# Altium schematic sheet Dashboard.SchDoc
size Letter
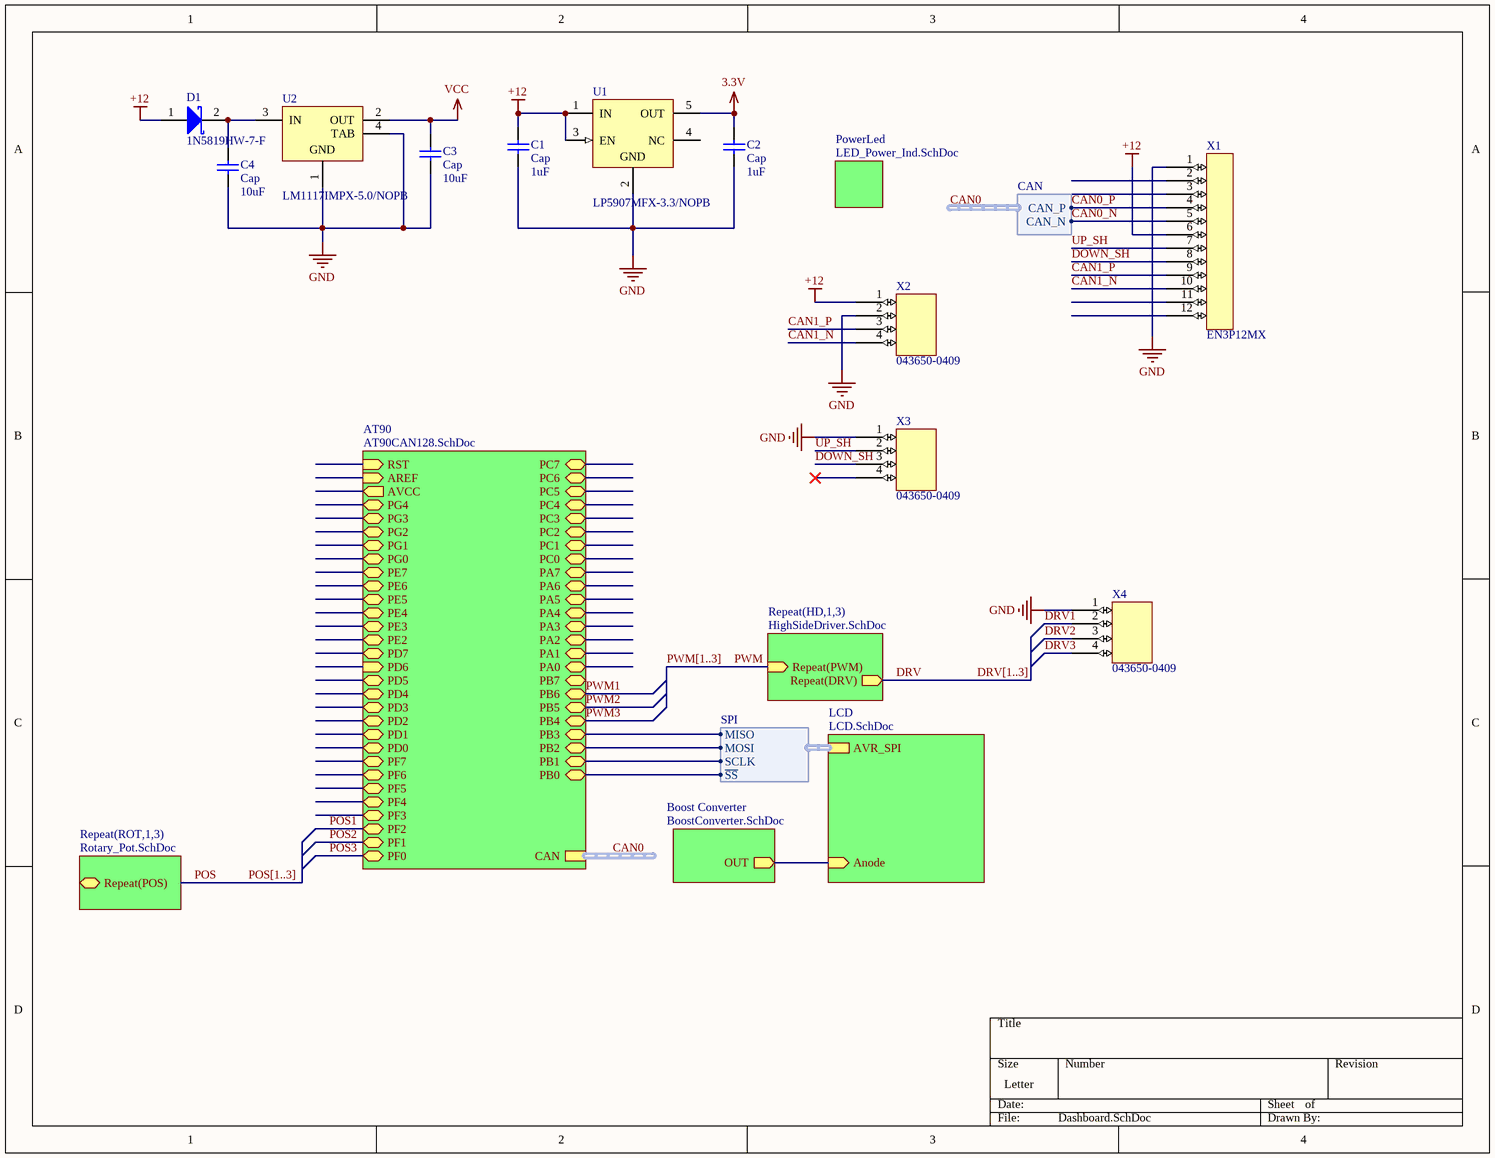
[diagram p0: Dashboard.SchDoc]

## Parts
C1  Cap  value 1uF  [1608[0603]]
C2  Cap  value 1uF  [1608[0603]]
C3  Cap  value 10uF  [1608[0603]]
C4  Cap  value 10uF  [1608[0603]]
D1  1N5819HW-7-F  [DIOD-SOD-123-2_V]
U1  LP5907MFX-3.3/NOPB  [DBV0005A_L]
U2  LM1117IMPX-5.0/NOPB  [MP04A_M]
X1  EN3P12MX  [EN3P12MX]
X2  043650-0409  [043650-0409]
X3  043650-0409  [043650-0409]
X4  043650-0409  [043650-0409]

## Sub-sheets
AT90 = AT90CAN128.SchDoc: PD6 (in), PD5 (bidir), RST (in), AREF (in), AVCC (out), PG2 (bidir), PG1 (bidir), PG0 (bidir), PE7 (bidir), PE6 (bidir), PE5 (bidir), PE4 (bidir), PE3 (bidir), PE2 (bidir), PD7 (bidir), PD4 (bidir), PD3 (bidir), PD2 (bidir), PD1 (bidir), PD0 (bidir), PF7 (bidir), PF6 (bidir), PF5 (bidir), PF4 (bidir), PF3 (bidir), PF2 (bidir), PF1 (bidir), PF0 (bidir), PC7 (bidir), PC6 (bidir), PC5 (bidir), PC4 (bidir), PC3 (bidir), PC2 (bidir), PC1 (bidir), PC0 (bidir), PA7 (bidir), PA6 (bidir), PA5 (bidir), PA4 (bidir), PA0 (bidir), PG4 (bidir), PA3 (bidir), PA2 (bidir), PB7 (bidir), PB6 (bidir), PA1 (bidir), PG3 (bidir), PB5 (bidir), PB4 (bidir), PB3 (bidir), PB2 (bidir), PB1 (bidir), PB0 (bidir), CAN (harness CAN)
Boost Converter = BoostConverter.SchDoc: OUT (out)
LCD = LCD.SchDoc: Anode (in), AVR_SPI (harness SPI)
PowerLed = LED_Power_Ind.SchDoc: no entries
Repeat(HD,1,3) = HighSideDriver.SchDoc: Repeat(PWM) (in), Repeat(DRV) (out)
Repeat(ROT,1,3) = Rotary_Pot.SchDoc: Repeat(POS) (bidir)

## Harnesses
SPI: ~{SS}, MISO, MOSI, SCLK
CAN: CAN_N, CAN_P

## Nets
3.3V: C2.1 U1.5(OUT)
+12: C1.1 D1.1(A) U1.1(IN) U1.3(EN) X1.6 X2.1
GND: C1.2 C2.2 C3.2 C4.2 U1.2(GND) U2.1(GND) U2.4(TAB) X1.1 X2.2 X3.1 X4.1
VCC: C3.1 U2.2(OUT)
CAN0_N: X1.5 ; sheet AT90/CAN.CAN_N  [project net CAN0.CAN_N]
CAN0_P: X1.4 ; sheet AT90/CAN.CAN_P  [project net CAN0.CAN_P]
CAN1_N: X1.10 X2.4
CAN1_P: X1.9 X2.3
DOWN_SH: X1.8 X3.3
DRV: sheet Repeat(HD,1,3)/Repeat(DRV)
DRV1: X4.2
DRV2: X4.3
DRV3: X4.4
POS1: sheet AT90/PF2
POS2: sheet AT90/PF1
POS3: sheet AT90/PF0
PWM: sheet Repeat(HD,1,3)/Repeat(PWM)
PWM1: sheet AT90/PB6
PWM2: sheet AT90/PB5
PWM3: sheet AT90/PB4
UP_SH: X1.7 X3.2
NetC4_1: C4.1 D1.2(K) U2.3(IN)
(unnamed): sheet LCD/Anode, sheet Boost Converter/OUT
(unnamed): sheet AT90/PB3, sheet LCD/AVR_SPI.MISO
(unnamed): sheet AT90/PB2, sheet LCD/AVR_SPI.MOSI
(unnamed): sheet AT90/PB1, sheet LCD/AVR_SPI.SCLK
(unnamed): sheet AT90/PB0, sheet LCD/AVR_SPI.~{SS}

Not connected (* = marked no-connect by the designer): U1 4(NC); X1 2 3 11 12; X3 4*

## Buses and harness runs
bus DRV[1..3]
bus POS[1..3]
bus PWM[1..3]
harness CAN0 = sheet AT90/CAN

## Library data of the parts
C1-C4 = Cap: Capacitor; Published: 8-Jun-2000; LatestRevisionDate: 17-Jul-2002; LatestRevisionNote: Re-released for DXP Platform.; PackageReference: RAD-0.3; Publisher: Altium Limited; PackageDescription: Radial Cap, Thru-Hole; 2 Leads; 0.3 in Pin Spacing
D1 = CMP-0303-00003-1: 1.0 A Surface Mount Schottky Barrier Rectifier, 40 V, -65 to 125 degC, 2-Pin SOD-123 Package, RoHS, Tape and Reel; Manufacturer: Diodes Inc; @ VR (V): 40; @ Terminal Temperature TT (degC): 90; Maximum Average Rectified Current IO (A): 1; Total Capacitance CT (pF): 50; Peak Forward Surge Current IFSM (A): 25; Forward Voltage Drop VF (V): 0.45; VR (RMS) (V): 28; RoHS: TRUE; PartNumber: 1N5819HW-7-F; ComponentLink2URL: http://www.diodes.com/datasheets/ds30217.pdf; PackageDescription: 2-Pin SOD-123, Body 2.7 x 1.55 mm, Pitch 3.7 mm; @ IF (A): 1; Operating and Storage Temperature Range: -65 to 125 degC; ComponentLink1Description: Manufacturer URL; ComponentLink2Description: Datasheet; ComponentLink1URL: http://www.diodes.com/; Mounting Technology: Surface Mount; DatasheetVersion: Rev. 15-2; PackageReference: SOD-123-2; Maximum Reverse Current IR (uA): 50; Peak Repetitive Reverse Voltage VRRM (V): 40; Packing: Tape and Reel
U1 = CMP-2000-07464-1: Ultra-Low-Noise, Low-IQ LDO, 0.25 A, Fixed 3.3 V Output, 2.2 to 5.5 V Input, -40 to 125 degC, 5-Pin SOT-23 (DBV), Green (RoHS & no Sb/Br), Tape and Reel; Manufacturer: Texas Instruments; Max Output Current: 250mA; Max Input Voltage: 5.5V; Dropout Voltage: 250mV; Number of Regulators: 1; Nominal Output Voltage: 3.3V; Output Voltage Accuracy: 2%; Polarity: Positive; Min Input Voltage: 2.2V; Package Version: 4073253-4/N, 12/2014; Quiescent Current: 425uA; Power Supply Rejection Ratio (PSRR): 82dB; Case\/Package: SOT-23; Lead Free: LeadFree; Package Reference: DBV5; Output Current: 250mA; Package Description: 5-Pin Small Outline Transistor, Body 2.9 x 1.6 mm, Pitch 0.95 mm; Max Operating Temperature: 125degC; Mounting Technology: SurfaceMount; Number of Pins: 5; Mount: SurfaceMount; Manufacturer URL: http://www.ti.com/; Accuracy: 2%; Package URL: http://www.ti.com/lit/ml/mpds018l/mpds018l.pdf; Output Voltage: 3.3V; Radiation Hardening: No; Number of Outputs: 1; Packaging: TapeandReel; RoHSCompliant: true; Min Operating Temperature: -40degC; Datasheet URL: http://www.ti.com/lit/ds/symlink/lp5907.pdf; Package Quantity: 3000; Datasheet Version: Rev. L, 09/2016; REACH SVHC: NoSVHC; Contact Plating: Tin
U2 = CMP-0062-01628-3: 800mA Low-Dropout Linear Regulator, 4-pin SOT-223, Pb-Free; Manufacturer: National Semiconductor; CompType: LDO IC; High-Reliability: Y; PackageTopMarking: XYTT*N06B; PowerWise: N; ComponentLink3Description: LM1117 Web Page; ComponentLink3URL: http://www.national.com/pf/LM/LM1117.html; DatasheetVersion: Apr-2006; ComponentLink2Description: LM1117 Datasheet; PackageVersion: revB, Apr-2003; ComponentLink4Description: MP04A Package Page; ComponentLink1Description: Manufacturer URL; PartNumber: LM1117IMPX-5.0/NOPB; ComponentLink1URL: http://www.national.com/; PackageReference: MP04A; ComponentLink2URL: http://www.national.com/ds/LM/LM1117.pdf; PinCount: 4; Code_JEDEC: TO-261-AA; RevisionNote: SCH symbol layout adjusted; ComponentLink4URL: http://www.national.com/packaging/folders/mp04a.html; RoHS: Y; Code_IPC: SOT223-4; PackageDescription: Molded SOT-223, 6.50 x 3.56 x 1.6mm Body, 4 Lead, 2.3mm Pitch